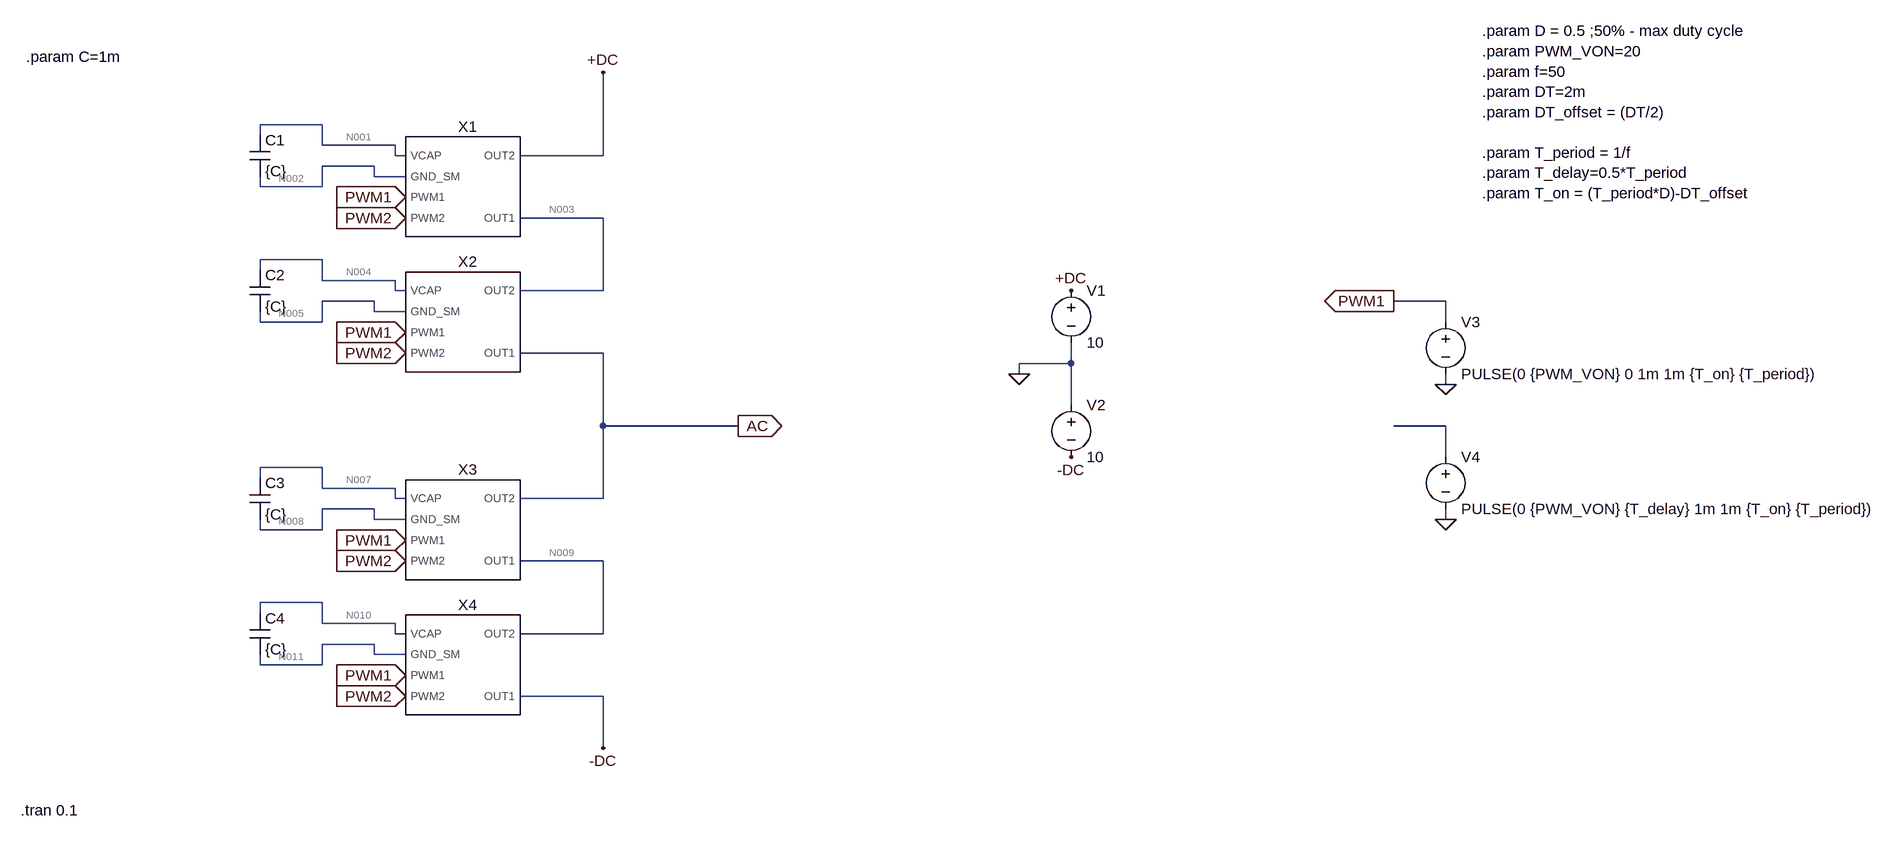
[diagram p0: schematic uMMC.asc]
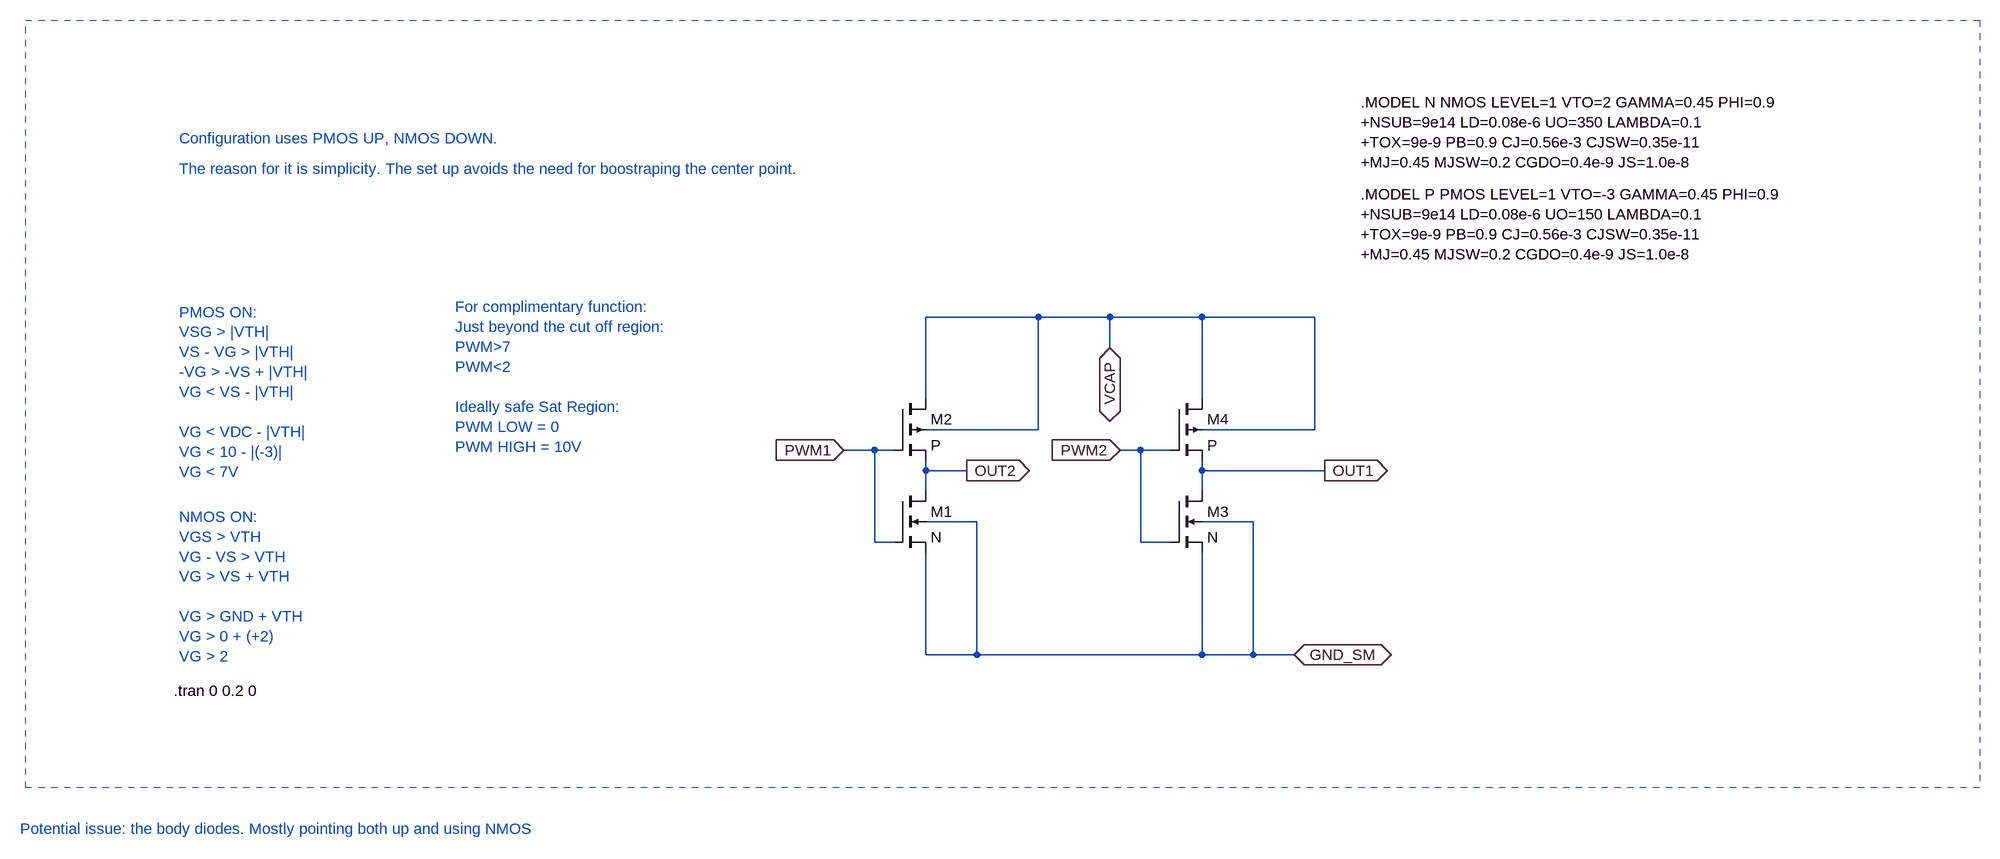
[diagram p1: sub-circuit h-bridge-only.asc]
uMMC.asc, the LTspice schematic file:
Version 4.1
SHEET 1 6084 928
WIRE 3616 -144 3520 -144
WIRE 3520 -128 3520 -144
WIRE 3616 -112 3616 -144
WIRE 3728 -112 3616 -112
WIRE 3728 -96 3728 -112
WIRE 3744 -96 3728 -96
WIRE 4048 -96 4048 -224
WIRE 4048 -96 3920 -96
WIRE 3696 -80 3616 -80
WIRE 3696 -64 3696 -80
WIRE 3744 -64 3696 -64
WIRE 3520 -48 3520 -64
WIRE 3616 -48 3616 -80
WIRE 3616 -48 3520 -48
WIRE 4048 0 3920 0
WIRE 3616 64 3520 64
WIRE 3520 80 3520 64
WIRE 3616 96 3616 64
WIRE 3728 96 3616 96
WIRE 3728 112 3728 96
WIRE 3744 112 3728 112
WIRE 4048 112 4048 0
WIRE 4048 112 3920 112
WIRE 3696 128 3616 128
WIRE 5344 128 5264 128
WIRE 3696 144 3696 128
WIRE 3744 144 3696 144
WIRE 3520 160 3520 144
WIRE 3616 160 3616 128
WIRE 3616 160 3520 160
WIRE 5344 160 5344 128
WIRE 4048 208 3920 208
WIRE 4768 224 4768 192
WIRE 4768 224 4688 224
WIRE 4688 240 4688 224
WIRE 5344 256 5344 240
WIRE 4768 288 4768 224
WIRE 4048 320 4048 208
WIRE 4256 320 4048 320
WIRE 5344 320 5264 320
WIRE 5344 368 5344 320
WIRE 3616 384 3520 384
WIRE 3520 400 3520 384
WIRE 3616 416 3616 384
WIRE 3728 416 3616 416
WIRE 3728 432 3728 416
WIRE 3744 432 3728 432
WIRE 4048 432 4048 320
WIRE 4048 432 3920 432
WIRE 3696 448 3616 448
WIRE 3696 464 3696 448
WIRE 3744 464 3696 464
WIRE 5344 464 5344 448
WIRE 3520 480 3520 464
WIRE 3616 480 3616 448
WIRE 3616 480 3520 480
WIRE 4048 528 3920 528
WIRE 3616 592 3520 592
WIRE 3520 608 3520 592
WIRE 3616 624 3616 592
WIRE 3728 624 3616 624
WIRE 3728 640 3728 624
WIRE 3744 640 3728 640
WIRE 4048 640 4048 528
WIRE 4048 640 3920 640
WIRE 3696 656 3616 656
WIRE 3696 672 3696 656
WIRE 3744 672 3696 672
WIRE 3520 688 3520 672
WIRE 3616 688 3616 656
WIRE 3616 688 3520 688
WIRE 4048 736 3920 736
WIRE 4048 816 4048 736
FLAG 4048 816 -DC
FLAG 4768 368 -DC
FLAG 4048 -224 +DC
FLAG 4768 112 +DC
FLAG 4688 240 0
FLAG 5344 256 0
FLAG 5344 464 0
FLAG 5264 128 PWM1
IOPIN 5264 128 Out
FLAG 3744 736 PWM2
IOPIN 3744 736 In
FLAG 3744 -32 PWM1
IOPIN 3744 -32 In
FLAG 3744 176 PWM1
IOPIN 3744 176 In
FLAG 3744 704 PWM1
IOPIN 3744 704 In
FLAG 3744 496 PWM1
IOPIN 3744 496 In
FLAG 3744 0 PWM2
IOPIN 3744 0 In
FLAG 3744 208 PWM2
IOPIN 3744 208 In
FLAG 3744 528 PWM2
IOPIN 3744 528 In
FLAG 4256 320 AC
IOPIN 4256 320 Out
SYMBOL H-BRIDGE-ONLY\\H-Bridge-only 3856 -48 R0
SYMATTR InstName X1
SYMBOL H-BRIDGE-ONLY\\H-Bridge-only 3856 160 R0
SYMATTR InstName X2
SYMBOL H-BRIDGE-ONLY\\H-Bridge-only 3856 480 R0
SYMATTR InstName X3
SYMBOL H-BRIDGE-ONLY\\H-Bridge-only 3856 688 R0
SYMATTR InstName X4
SYMBOL cap 3504 -128 R0
SYMATTR InstName C1
SYMATTR Value {C}
SYMBOL cap 3504 80 R0
SYMATTR InstName C2
SYMATTR Value {C}
SYMBOL cap 3504 400 R0
SYMATTR InstName C3
SYMATTR Value {C}
SYMBOL cap 3504 608 R0
SYMATTR InstName C4
SYMATTR Value {C}
SYMBOL voltage 4768 96 R0
WINDOW 123 0 0 Left 0
WINDOW 39 0 0 Left 0
SYMATTR InstName V1
SYMATTR Value 10
SYMBOL voltage 4768 272 R0
WINDOW 123 0 0 Left 0
WINDOW 39 0 0 Left 0
SYMATTR InstName V2
SYMATTR Value 10
SYMBOL voltage 5344 144 R0
WINDOW 123 0 0 Left 0
WINDOW 39 0 0 Left 0
SYMATTR InstName V3
SYMATTR Value PULSE(0 {PWM_VON} 0 1m 1m {T_on} {T_period})
SYMBOL voltage 5344 352 R0
WINDOW 123 0 0 Left 0
WINDOW 39 0 0 Left 0
SYMATTR InstName V4
SYMATTR Value PULSE(0 {PWM_VON} {T_delay} 1m 1m {T_on} {T_period})
TEXT 3160 -248 Left 2 !.param C=1m
TEXT 3152 912 Left 2 !.tran 0.1
TEXT 5400 -288 Left 2 !.param D = 0.5 ;50% - max duty cycle\n.param PWM_VON=20\n.param f=50\n.param DT=2m\n.param DT_offset = (DT/2)\n \n.param T_period = 1/f\n.param T_delay=0.5*T_period\n.param T_on = (T_period*D)-DT_offset

h-bridge-only.asc, the sub-circuit schematic file:
Version 4.1
SHEET 1 3540 848
WIRE 1904 32 1728 32
WIRE 2016 32 1904 32
WIRE 2160 32 2016 32
WIRE 2336 32 2160 32
WIRE 2016 80 2016 32
WIRE 1728 160 1728 32
WIRE 2160 160 2160 32
WIRE 1904 208 1904 32
WIRE 1904 208 1728 208
WIRE 2336 208 2336 32
WIRE 2336 208 2160 208
WIRE 1648 240 1600 240
WIRE 1680 240 1648 240
WIRE 2064 240 2032 240
WIRE 2112 240 2064 240
WIRE 1728 272 1728 256
WIRE 1792 272 1728 272
WIRE 2160 272 2160 256
WIRE 2352 272 2160 272
WIRE 1728 304 1728 272
WIRE 2160 304 2160 272
WIRE 1808 352 1728 352
WIRE 2240 352 2160 352
WIRE 1648 384 1648 240
WIRE 1680 384 1648 384
WIRE 2064 384 2064 240
WIRE 2112 384 2064 384
WIRE 1728 560 1728 400
WIRE 1808 560 1808 352
WIRE 1808 560 1728 560
WIRE 2160 560 2160 400
WIRE 2160 560 1808 560
WIRE 2240 560 2240 352
WIRE 2240 560 2160 560
WIRE 2304 560 2240 560
FLAG 1600 240 PWM1
IOPIN 1600 240 In
FLAG 2032 240 PWM2
IOPIN 2032 240 In
FLAG 1792 272 OUT2
IOPIN 1792 272 Out
FLAG 2352 272 OUT1
IOPIN 2352 272 Out
FLAG 2016 80 VCAP
IOPIN 2016 80 BiDir
FLAG 2304 560 GND_SM
IOPIN 2304 560 BiDir
SYMBOL nmos4 1680 304 R0
SYMATTR InstName M1
SYMATTR Value N
SYMBOL pmos4 1680 160 R0
SYMATTR InstName M2
SYMATTR Value P
SYMBOL nmos4 2112 304 R0
SYMATTR InstName M3
SYMATTR Value N
SYMBOL pmos4 2112 160 R0
SYMATTR InstName M4
SYMATTR Value P
TEXT 2408 -304 Left 2 !.MODEL N NMOS LEVEL=1 VTO=2 GAMMA=0.45 PHI=0.9\n+NSUB=9e14 LD=0.08e-6 UO=350 LAMBDA=0.1\n+TOX=9e-9 PB=0.9 CJ=0.56e-3 CJSW=0.35e-11\n+MJ=0.45 MJSW=0.2 CGDO=0.4e-9 JS=1.0e-8
TEXT 2408 -160 Left 2 !.MODEL P PMOS LEVEL=1 VTO=-3 GAMMA=0.45 PHI=0.9\n+NSUB=9e14 LD=0.08e-6 UO=150 LAMBDA=0.1\n+TOX=9e-9 PB=0.9 CJ=0.56e-3 CJSW=0.35e-11\n+MJ=0.45 MJSW=0.2 CGDO=0.4e-9 JS=1.0e-8
TEXT 560 -248 Left 2 ;Configuration uses PMOS UP, NMOS DOWN.
TEXT 560 -200 Left 2 ;The reason for it is simplicity. The set up avoids the need for boostraping the center point.
TEXT 560 24 Left 2 ;PMOS ON: \nVSG > |VTH| \nVS - VG > |VTH| \n-VG > -VS + |VTH| \nVG < VS - |VTH| \n \nVG < VDC - |VTH| \nVG < 10 - |(-3)|\nVG < 7V
TEXT 560 344 Left 2 ;NMOS ON:\nVGS > VTH\nVG - VS > VTH \nVG > VS + VTH\n \nVG > GND + VTH \nVG > 0 + (+2) \nVG > 2
TEXT 992 16 Left 2 ;For complimentary function: \nJust beyond the cut off region: \nPWM>7 \nPWM<2\n \nIdeally safe Sat Region: \nPWM LOW = 0\nPWM HIGH = 10V
TEXT 552 616 Left 2 !.tran 0 0.2 0
TEXT 312 832 Left 2 ;Potential issue: the body diodes. Mostly pointing both up and using NMOS
RECTANGLE Normal 3376 768 320 -432 2

The netlist it stands for:
* uMMC.asc
X§X1 +DC N003 N001 N002 PWM1 PWM2 h-bridge-only
X§X2 N003 AC N004 N005 PWM1 PWM2 h-bridge-only
X§X3 AC N009 N007 N008 PWM1 PWM2 h-bridge-only
X§X4 N009 -DC N010 N011 PWM1 PWM2 h-bridge-only
C1 N001 N002 {C}
C2 N004 N005 {C}
C3 N007 N008 {C}
C4 N010 N011 {C}
V1 +DC 0 10
V2 0 -DC 10
V3 PWM1 0 PULSE(0 {PWM_VON} 0 1m 1m {T_on} {T_period})
V4 N006 0 PULSE(0 {PWM_VON} {T_delay} 1m 1m {T_on} {T_period})

* block symbol definitions
.subckt h-bridge-only OUT2 OUT1 VCAP GND_SM PWM1 PWM2
M1 OUT2 PWM1 GND_SM GND_SM N
M2 VCAP PWM1 OUT2 VCAP P
M3 OUT1 PWM2 GND_SM GND_SM N
M4 VCAP PWM2 OUT1 VCAP P
.MODEL N NMOS LEVEL=1 VTO=2 GAMMA=0.45 PHI=0.9
+NSUB=9e14 LD=0.08e-6 UO=350 LAMBDA=0.1
+TOX=9e-9 PB=0.9 CJ=0.56e-3 CJSW=0.35e-11
+MJ=0.45 MJSW=0.2 CGDO=0.4e-9 JS=1.0e-8
.MODEL P PMOS LEVEL=1 VTO=-3 GAMMA=0.45 PHI=0.9
+NSUB=9e14 LD=0.08e-6 UO=150 LAMBDA=0.1
+TOX=9e-9 PB=0.9 CJ=0.56e-3 CJSW=0.35e-11
+MJ=0.45 MJSW=0.2 CGDO=0.4e-9 JS=1.0e-8
* Configuration uses PMOS UP, NMOS DOWN.
* The reason for it is simplicity. The set up avoids the need for boostraping the center point.
* PMOS ON:
* VSG > |VTH|
* VS - VG > |VTH|
* -VG > -VS + |VTH|
* VG < VS - |VTH|
* VG < VDC - |VTH|
* VG < 10 - |(-3)|
* VG < 7V
* NMOS ON:
* VGS > VTH
* VG - VS > VTH
* VG > VS + VTH
* VG > GND + VTH
* VG > 0 + (+2)
* VG > 2
* For complimentary function:
* Just beyond the cut off region:
* PWM>7
* PWM<2
* Ideally safe Sat Region:
* PWM LOW = 0
* PWM HIGH = 10V
.tran 0 0.2 0
* Potential issue: the body diodes. Mostly pointing both up and using NMOS
.ends h-bridge-only

.model NMOS NMOS
.model PMOS PMOS
.lib standard.mos
.param C=1m
.tran 0.1
.param D = 0.5 ;50% - max duty cycle
.param PWM_VON=20
.param f=50
.param DT=2m
.param DT_offset = (DT/2)
.param T_period = 1/f
.param T_delay=0.5*T_period
.param T_on = (T_period*D)-DT_offset
.backanno
.end

* Results of the author's LTspice run, read from the files saved beside the schematic
* Operating Point, zero values left out:
*   V(n003) = 5.548 V
*   V(n002) = 5.722 V
*   V(ac) = -5.505 V
*   V(n009) = -8.041 V
*   V(n008) = -7.392 V
*   V(-dc) = -10 V
*   V(n011) = -9.357 V
*   V(+dc) = 10 V
*   V(n001) = 9.343 V
*   V(n004) = 4.944 V
*   V(n005) = -4.856 V
*   V(n007) = -5.663 V
*   V(n010) = -8.191 V
*   I(V1) = -1.342 mA
*   I(V2) = -1.342 mA
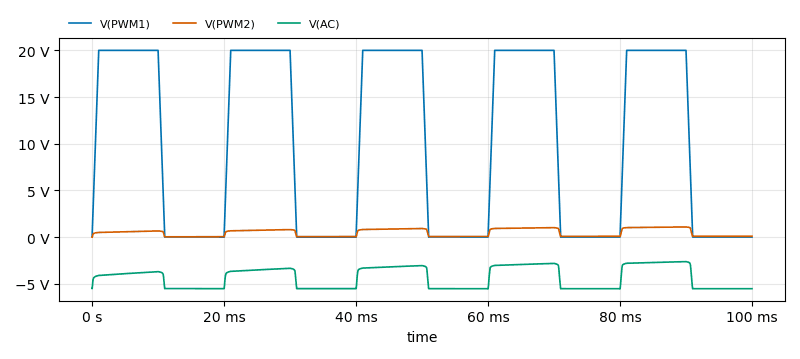
[diagram p2: Transient Analysis of uMMC.asc, plotted from the saved traces]
* Transient Analysis, 1 run:
*   V(PWM1): min 0 V, max 20 V, average 10 V, rms 13.91 V, last 0 V
*   V(PWM2): min -8.687 mV, max 1.085 V, average 472.7 mV, rms 620.8 mV, last 88.21 mV
*   V(AC): min -5.542 V, max -2.629 V, average -4.314 V, rms 4.468 V, last -5.529 V